# EAGLE design 5VSwitchablePowerOutput (EAGLE 8.0.0)
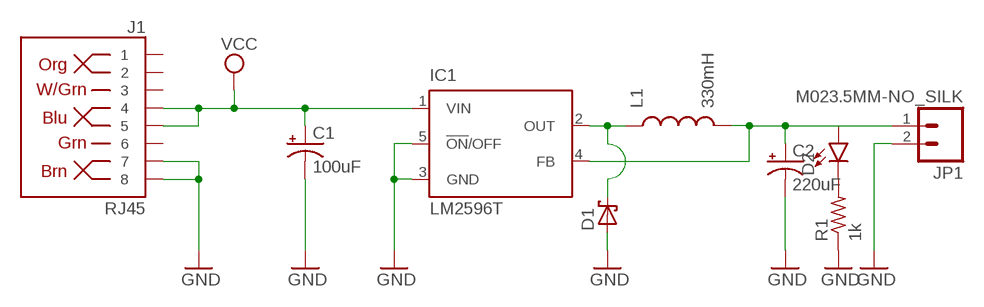
[diagram p0: schematic, sheet 1]

## Parts
C1  100uF  CPOL-USE5-13  [E5-13]
C2  220uF  CPOL-USE3.5-10  [E3,5-10]
D1  SCHOTTKY-DIODECB417-15  [CB417-15]
D2  LED5MM  [LED_5MM]
IC1  LM2596T  [T05D]
J1  RJ45  RJ45-8  [RJ45-8]
JP1  M023.5MM-NO_SILK  [SCREWTERMINAL-3.5MM-2-NS]
L1  330mH  INDUCTORRLB0912  [RLB0912]
R1  1k  R-US_0204/7  [0204/7]

## Nets
GND: C1.- C2.- D1.A IC1.3(GND) IC1.5(!ON!/OFF) J1.7 J1.8 JP1.2 R1.1
N$2: D1.C IC1.2(OUT) L1.1
N$3: C2.+ D2.A IC1.4(FB) JP1.1 L1.2
N$7: D2.K(C) R1.2
VCC: C1.+ IC1.1(VIN) J1.4 J1.5
Unconnected: J1.1 J1.2 J1.3 J1.6

## Library data of the parts
C1 C2 = rcl:CPOL-US: POLARIZED CAPACITOR, American symbol
D1 = adafruit:SCHOTTKY-DIODE: Schottky Diode
D2 = SparkFun-LED:LED: LED (Generic) Standard schematic elements and footprints for 5mm, 3mm, 1206, and 0603 sized LEDs. Generic LEDs with no color specified.
IC1 = national-semiconductor:LM2596: SIMPLE SWITCHER® Power Converter 150 kHz 3A Step-Down Voltage Regulator Source: http://www.national.com/ds/LM/LM2596.pdf; MPN: LM2596T-ADJ/LF02; OC_FARNELL: 9494162; OC_NEWARK: 65K5910
J1 = SparkFun-Connectors:RJ45-8: RJ45 Jack - 8 pin Simple RJ45, 8-pin connection. Commonly used for Cat5, Cat5e, and Cat6 Ethernet cables. Here is the connector we sell at SparkFun: RJ45 8-Pin Connector <https://www.sparkfun.com/products/643> (PRT-00643) Datasheet <https://cdn.sparkfun.com/datasheets/Prototyping/04908.pdf> It is used on this SparkFun product: SparkFun RJ45 Breakout <https://www.sparkfun.com/products/716> (BOB-00716) Note, you may also be interested in the "MAGJACK" version of this. It is basically a RJ45 connector, but also has some status LEDs built into the connector housing. You can check that out in this library at the device named "MAGJACK.dev" and see these products online: RJ45 Ethernet MagJack-Compatible <https://www.sparkfun.com/products/8534> (PRT-08534) SparkFun RJ45 MagJack Breakout <https://www.sparkfun.com/products/13021> (BOB-13021); PROD_ID: CONN-08506; SF_ID: PRT-00643
JP1 = SparkFun-Connectors:M02: Standard 2-pin 0.1" header. Use with - straight break away headers ( PRT-00116) - right angle break away headers (PRT-00553) - swiss pins (PRT-00743) - machine pins (PRT-00117) - female headers (PRT-00115) Molex polarized connector foot print use with: PRT-08233 with associated crimp pins and housings. 2.54_SCREWTERM for use with PRT-10571. 3.5mm Screw Terminal footprints for PRT-08084 5mm Screw Terminal footprints for use with PRT-08433
L1 = SparkFun-Passives:INDUCTOR: Inductors Basic Inductor/Choke - 0603 and 1206. Footprints are not proven and vary greatly between part numbers. SRN6045- 33uH, 20% 1.4A
R1 = rcl:R-US_: RESISTOR, American symbol

## Board
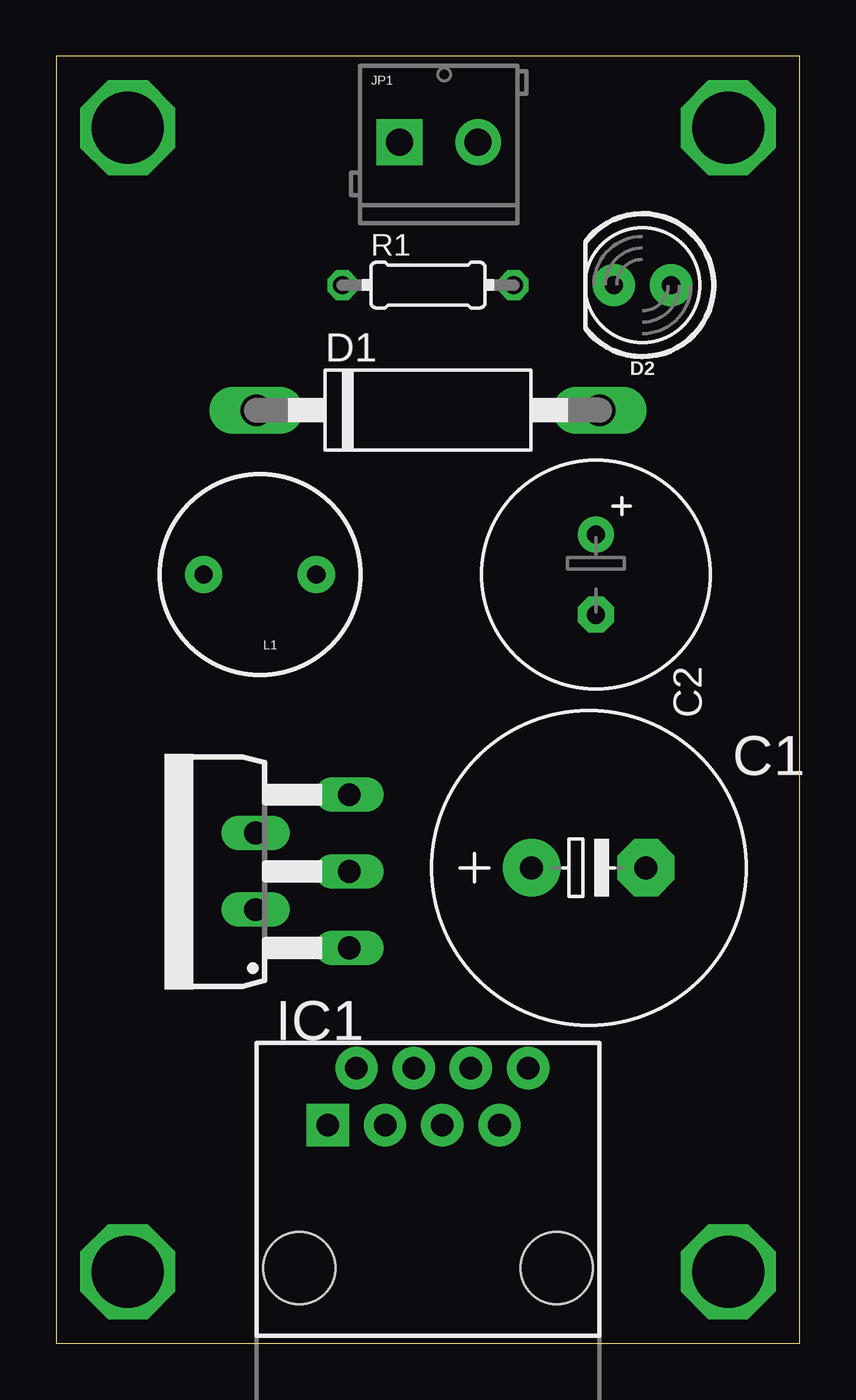
[diagram p1: board, top side]
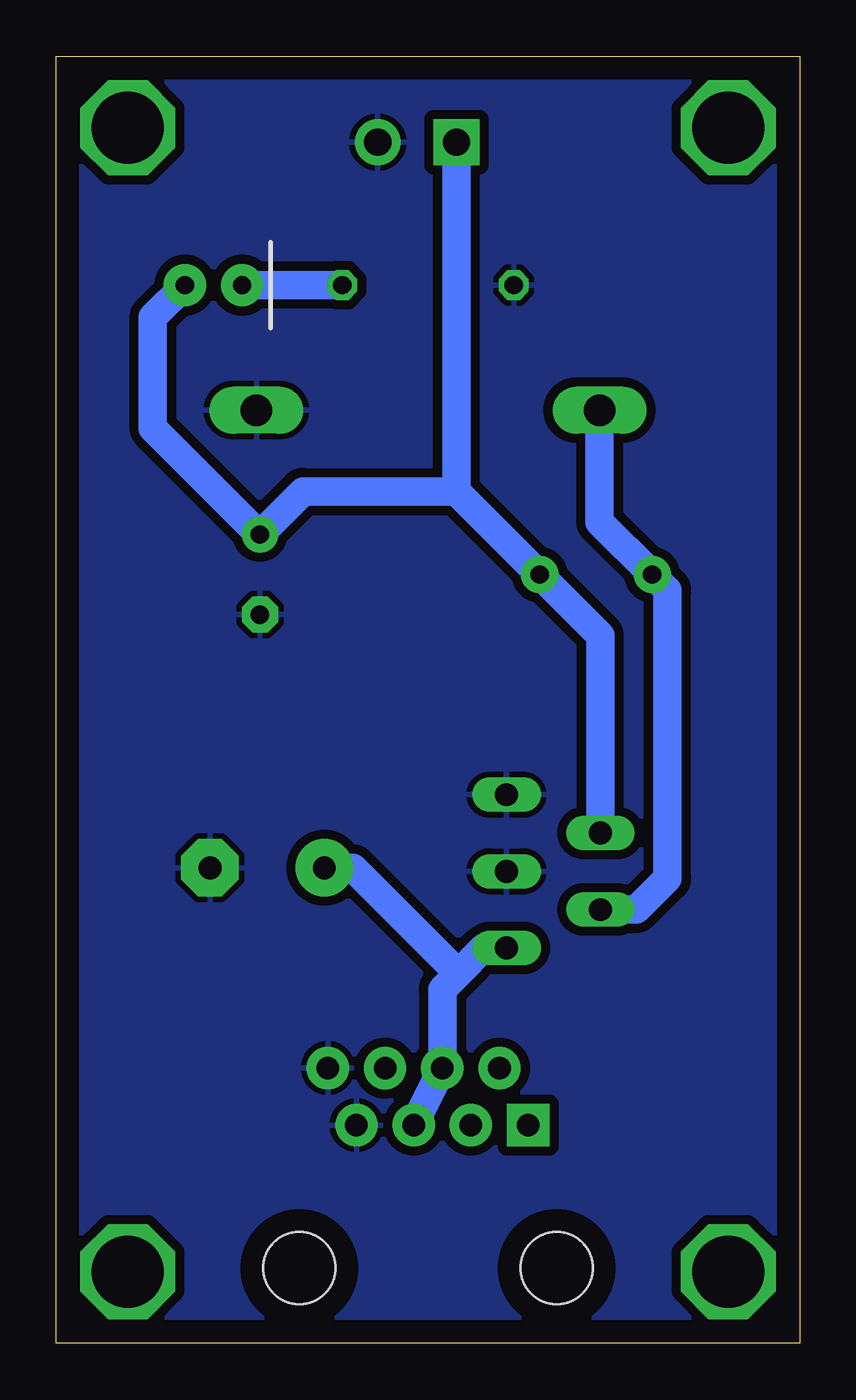
[diagram p2: board, bottom side, seen from below]

Size 33.02 x 57.15 mm. Coordinates in mm from the lower left corner, seen from the top.
Outline: 0,0 33.02,0 33.02,57.15 0,57.15 0,0
Copper layers (1*16): Top 0.035mm / dielectric 1.5mm / Bottom 0.035mm
Design rules "default": minimum track width 10mil, minimum drill 24mil, track to track 8mil, track to pad 8mil, pad to pad 8mil, via to via 8mil, smd to smd 8mil, copper to edge 40mil, drill to drill 8mil, minimum pad ring 10mil, minimum via ring 8mil, stop-mask expansion 4mil, vias tented up to drill 0mil, thermal gap 10mil

### Footprints (pad centres in the part's own frame; a part is rotated, then mirrored left to right if it is on the bottom)
E5-13 = drill 1.016 pad 2.54: + -2.54,0 | drill 1.016 pad 2.54 octagon: - 2.54,0
E3,5-10 = drill 0.813 pad 1.6: + -1.778,0 | drill 0.813 pad 1.6 octagon: - 1.778,0
CB417-15 = drill 1.397 long: A 7.62,0; C -7.62,0
LED_5MM = drill 0.813 pad 1.88: A -1.27,0; K 1.27,0
T05D = drill 1.016 long: 1 -3.404,-5.08; 2 -1.702,-0.914; 3 0,-5.08; 4 1.702,-0.914; 5 3.404,-5.08
RJ45-8 = drill 1 pad 1.88 square: 1 -4.445,6.35 | drill 1 pad 1.88: 2 -3.175,8.89; 3 -1.905,6.35; 4 -0.635,8.89; 5 0.635,6.35; 6 1.905,8.89; 7 3.175,6.35; 8 4.445,8.89 | hole 3.2: -5.715,0; 5.715,0
SCREWTERMINAL-3.5MM-2-NS = drill 1.2 pad 2.032 square: 1 0,0 | drill 1.2 pad 2.032: 2 3.5,0
RLB0912 = drill 0.813 pad 1.651: 1 2.502,0; 2 -2.502,0
0204/7 = drill 0.813 octagon: 1 -3.81,0; 2 3.81,0

### Placement (x,y rotation side)
C1  23.65,21.11 0 top
C2  23.97,34.13 270 top
D1  16.51,41.43 0 top
D2  26.04,46.99 180 top
IC1  7.94,20.95 90 top
J1  16.51,3.33 0 top
JP1  15.24,53.34 0 top
L1  9.05,34.13 180 top
R1  16.51,46.99 0 top

### Tracks (layer width: path | path; a pad name or v marks a point on that pad's centre or on a via)
GND
  pour Bottom (isolate 0.406): 0.16,57.15 33.66,57.31 33.66,0.16 0.16,0.16
N$1  (via drill 3.2)
  other vias: 3.17,53.98
N$2
  Bottom 1.27: IC1.2 7.26,19.25 5.87,20.64 5.87,33.46 L1.1 8.89,36.47 D1.C
N$3
  Bottom 1.27: IC1.4 8.85,31.43 L1.2 15.24,37.82 | 15.24,37.82 JP1.1 | 15.24,37.82 22.06,37.82 C2.+ 24,35.91 28.73,40.64 28.73,45.56 D2.A
N$4  (via drill 3.2)
  other vias: 29.84,53.98
N$5  (via drill 3.2)
  other vias: 3.17,3.17
N$6  (via drill 3.2)
  other vias: 29.84,3.17
N$7
  Bottom 1.27: R1.2 D2.K
VCC
  Bottom 1.27: J1.5 J1.4 15.88,15.72 15.16,16.43 | IC1.1 14.04,17.55 15.16,16.43 | C1.+ 19.84,21.11 15.16,16.43